# Altium schematic sheet Digital_Input_LED_Monitor.SchDoc: TTL IO LED Monitor
size Tabloid; Date: 05/10/2023; Engineer: Terry D. Schevker; Revision: 1.0; SheetNumber: 3; SheetTotal: 3
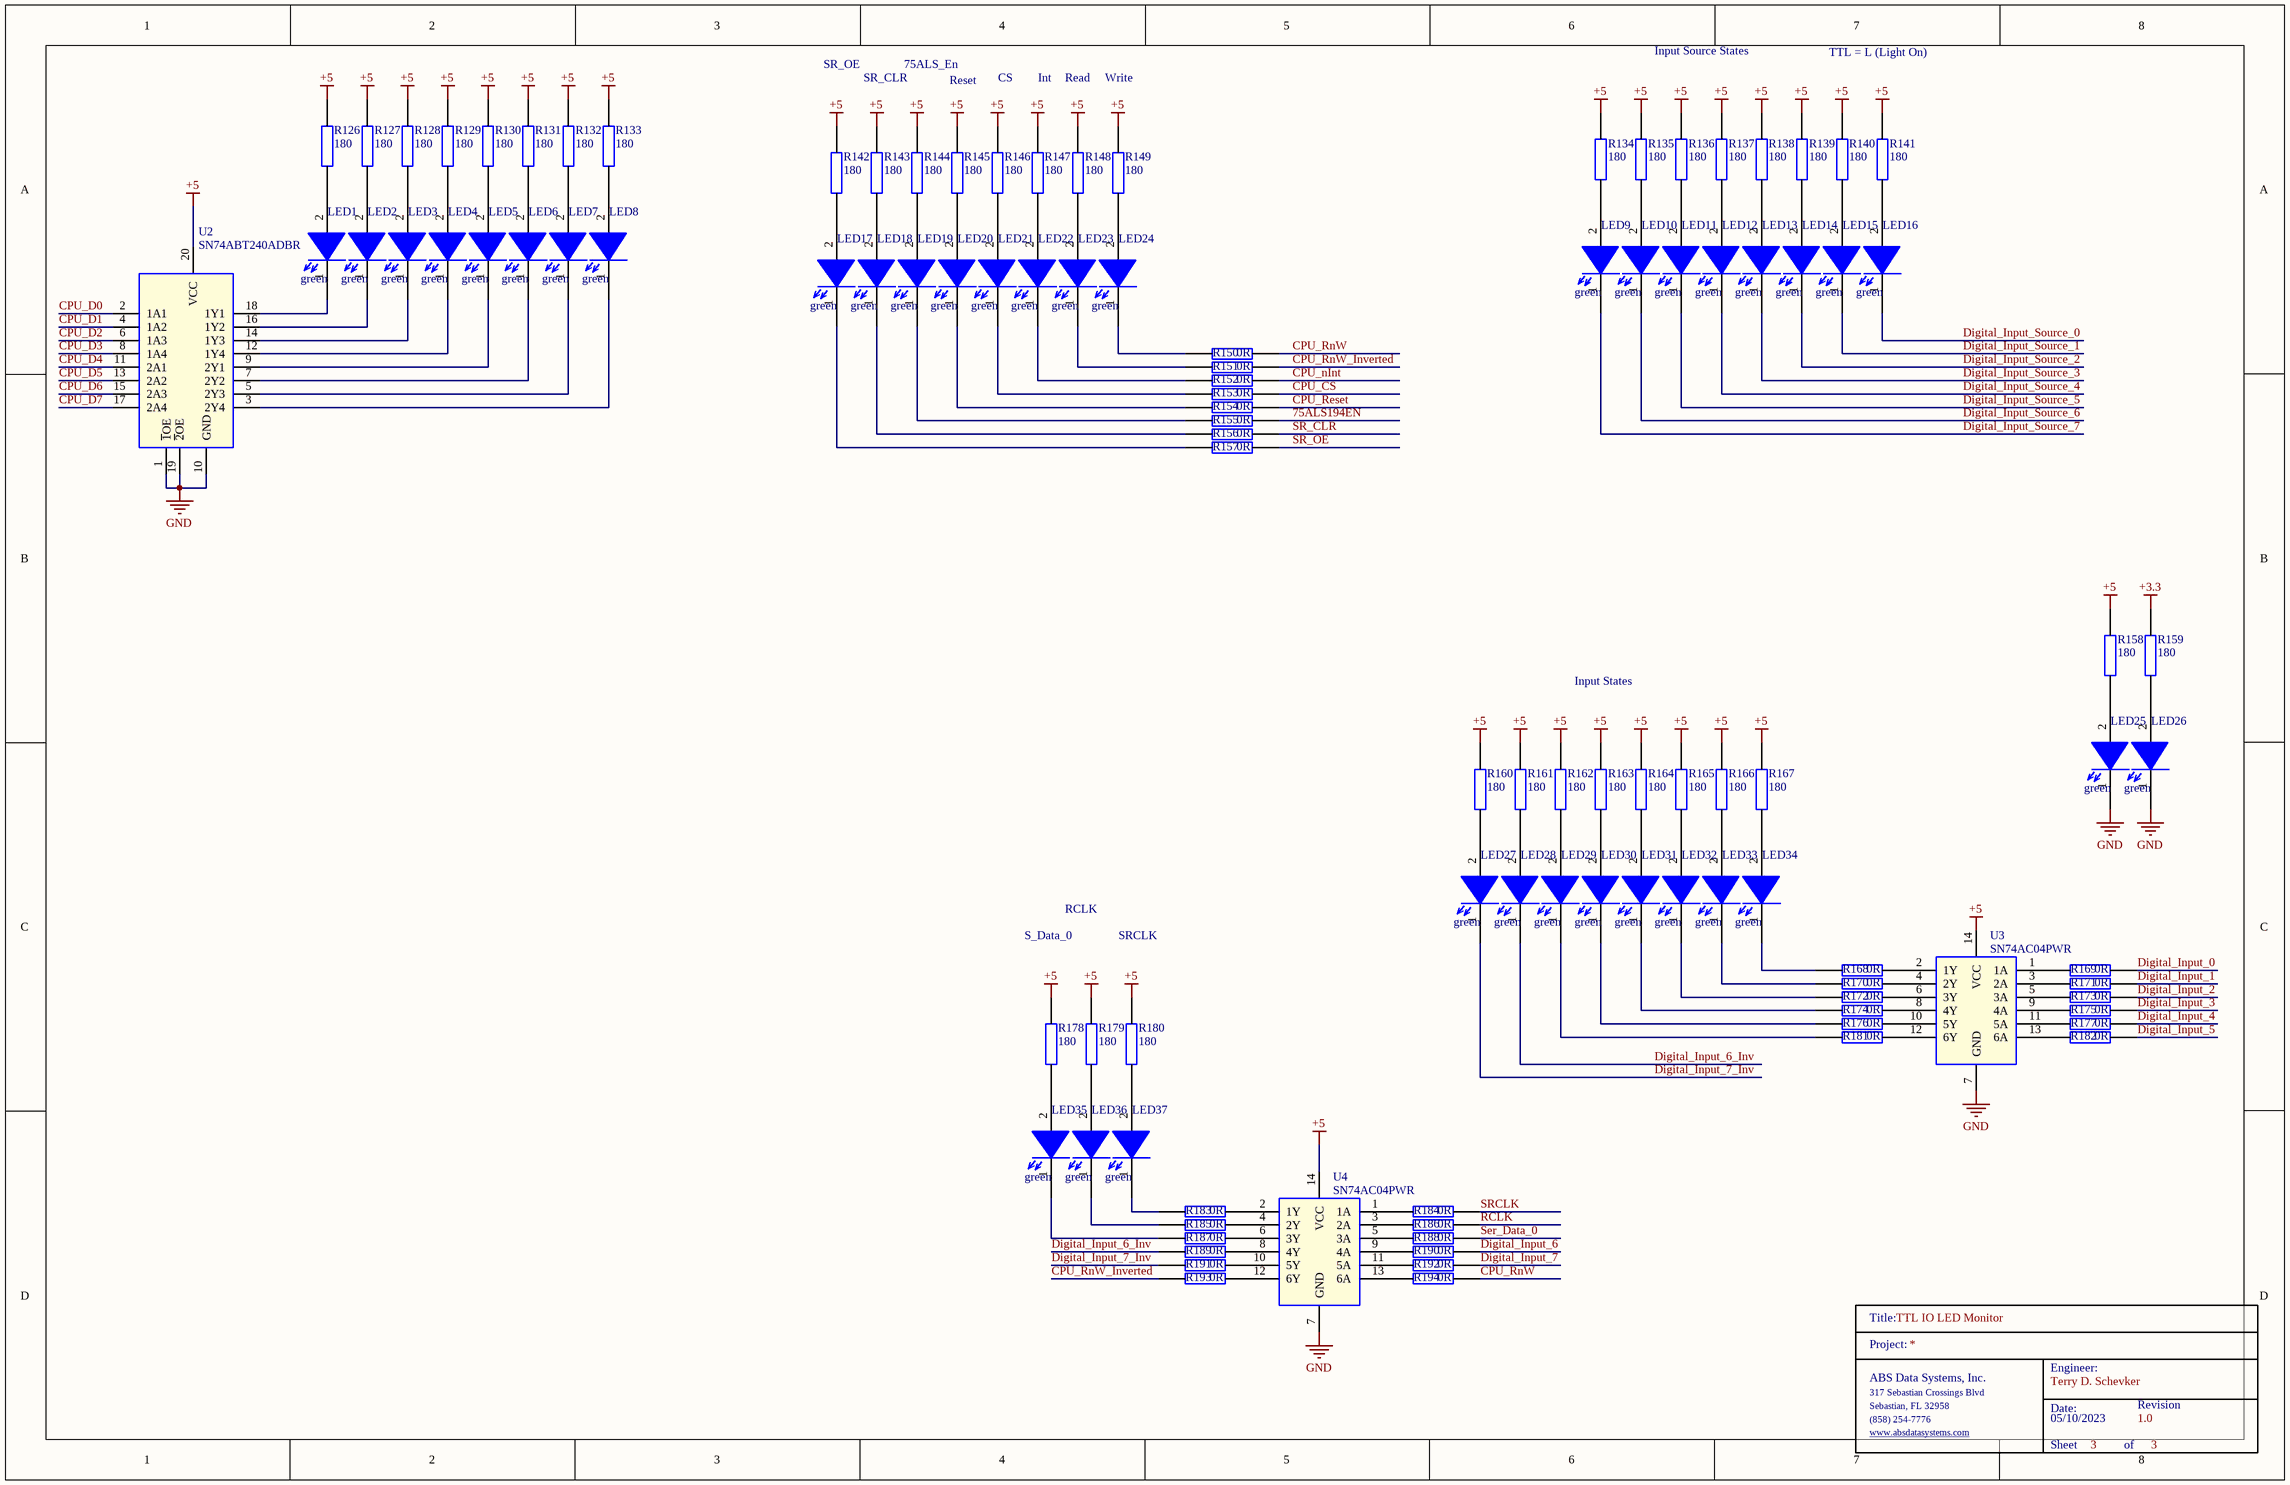
[diagram p0: Digital_Input_LED_Monitor.SchDoc]

## Parts
LED1  green  [0603_Diode]
LED2  green  [0603_Diode]
LED3  green  [0603_Diode]
LED4  green  [0603_Diode]
LED5  green  [0603_Diode]
LED6  green  [0603_Diode]
LED7  green  [0603_Diode]
LED8  green  [0603_Diode]
LED9  green  [0603_Diode]
LED10  green  [0603_Diode]
LED11  green  [0603_Diode]
LED12  green  [0603_Diode]
LED13  green  [0603_Diode]
LED14  green  [0603_Diode]
LED15  green  [0603_Diode]
LED16  green  [0603_Diode]
LED17  green  [0603_Diode]
LED18  green  [0603_Diode]
LED19  green  [0603_Diode]
LED20  green  [0603_Diode]
LED21  green  [0603_Diode]
LED22  green  [0603_Diode]
LED23  green  [0603_Diode]
LED24  green  [0603_Diode]
LED25  green  [0603_Diode]
LED26  green  [0603_Diode]
LED27  green  [0603_Diode]
LED28  green  [0603_Diode]
LED29  green  [0603_Diode]
LED30  green  [0603_Diode]
LED31  green  [0603_Diode]
LED32  green  [0603_Diode]
LED33  green  [0603_Diode]
LED34  green  [0603_Diode]
LED35  green  [0603_Diode]
LED36  green  [0603_Diode]
LED37  green  [0603_Diode]
R126  180  [0603]
R127  180  [0603]
R128  180  [0603]
R129  180  [0603]
R130  180  [0603]
R131  180  [0603]
R132  180  [0603]
R133  180  [0603]
R134  180  [0603]
R135  180  [0603]
R136  180  [0603]
R137  180  [0603]
R138  180  [0603]
R139  180  [0603]
R140  180  [0603]
R141  180  [0603]
R142  180  [0603]
R143  180  [0603]
R144  180  [0603]
R145  180  [0603]
R146  180  [0603]
R147  180  [0603]
R148  180  [0603]
R149  180  [0603]
R150  0R  [0603]
R151  0R  [0603]
R152  0R  [0603]
R153  0R  [0603]
R154  0R  [0603]
R155  0R  [0603]
R156  0R  [0603]
R157  0R  [0603]
R158  180  [0603]
R159  180  [0603]
R160  180  [0603]
R161  180  [0603]
R162  180  [0603]
R163  180  [0603]
R164  180  [0603]
R165  180  [0603]
R166  180  [0603]
R167  180  [0603]
R168  0R  [0603]
R169  0R  [0603]
R170  0R  [0603]
R171  0R  [0603]
R172  0R  [0603]
R173  0R  [0603]
R174  0R  [0603]
R175  0R  [0603]
R176  0R  [0603]
R177  0R  [0603]
R178  180  [0603]
R179  180  [0603]
R180  180  [0603]
R181  0R  [0603]
R182  0R  [0603]
R183  0R  [0603]
R184  0R  [0603]
R185  0R  [0603]
R186  0R  [0603]
R187  0R  [0603]
R188  0R  [0603]
R189  0R  [0603]
R190  0R  [0603]
R191  0R  [0603]
R192  0R  [0603]
R193  0R  [0603]
R194  0R  [0603]
TitleBlock_2  TitleBlock  (value not drawn)  (graphical)
U2  SN74ABT240ADBR  [SOP65P780X200-20N]
U3  SN74AC04PWR  [SOP65P640X120-14N]
U4  SN74AC04PWR  [SOP65P640X120-14N]

## Nets
+3.3: R159.2
+5: R126.2 R127.2 R128.2 R129.2 R130.2 R131.2 R132.2 R133.2 R134.2 R135.2 R136.2 R137.2 R138.2 R139.2 R140.2 R141.2 R142.2 R143.2 R144.2 R145.2 R146.2 R147.2 R148.2 R149.2 R158.2 R160.2 R161.2 R162.2 R163.2 R164.2 R165.2 R166.2 R167.2 R178.2 R179.2 R180.2 U2.20(VCC) U3.14(VCC) U4.14(VCC)
GND: LED25.1(K) LED26.1(K) U2.1(~{1}OE) U2.10(GND) U2.19(~{2}OE) U3.7(GND) U4.7(GND)
75ALS194EN: R155.2
CPU_CS: R153.2
CPU_D0: U2.2(1A1)
CPU_D1: U2.4(1A2)
CPU_D2: U2.6(1A3)
CPU_D3: U2.8(1A4)
CPU_D4: U2.11(2A1)
CPU_D5: U2.13(2A2)
CPU_D6: U2.15(2A3)
CPU_D7: U2.17(2A4)
CPU_nInt: R152.2
CPU_Reset: R154.2
CPU_RnW: R150.2 R194.2
CPU_RnW_Inverted: R151.2 R193.1
Digital_Input_0: R169.2
Digital_Input_1: R171.2
Digital_Input_2: R173.2
Digital_Input_3: R175.2
Digital_Input_4: R177.2
Digital_Input_5: R182.2
Digital_Input_6: R190.2
Digital_Input_6_Inv: LED28.1(K) R189.1
Digital_Input_7: R192.2
Digital_Input_7_Inv: LED27.1(K) R191.1
Digital_Input_Source_0: LED16.1(K)
Digital_Input_Source_1: LED15.1(K)
Digital_Input_Source_2: LED14.1(K)
Digital_Input_Source_3: LED13.1(K)
Digital_Input_Source_4: LED12.1(K)
Digital_Input_Source_5: LED11.1(K)
Digital_Input_Source_6: LED10.1(K)
Digital_Input_Source_7: LED9.1(K)
RCLK: R186.2
Ser_Data_0: R188.2
SR_CLR: R156.2
SR_OE: R157.2
SRCLK: R184.2
NetLED1_1: LED1.1(K) U2.18(1Y1)
NetLED1_2: LED1.2(A) R126.1
NetLED2_1: LED2.1(K) U2.16(1Y2)
NetLED2_2: LED2.2(A) R127.1
NetLED3_1: LED3.1(K) U2.14(1Y3)
NetLED3_2: LED3.2(A) R128.1
NetLED4_1: LED4.1(K) U2.12(1Y4)
NetLED4_2: LED4.2(A) R129.1
NetLED5_1: LED5.1(K) U2.9(2Y1)
NetLED5_2: LED5.2(A) R130.1
NetLED6_1: LED6.1(K) U2.7(2Y2)
NetLED6_2: LED6.2(A) R131.1
NetLED7_1: LED7.1(K) U2.5(2Y3)
NetLED7_2: LED7.2(A) R132.1
NetLED8_1: LED8.1(K) U2.3(2Y4)
NetLED8_2: LED8.2(A) R133.1
NetLED9_2: LED9.2(A) R134.1
NetLED10_2: LED10.2(A) R135.1
NetLED11_2: LED11.2(A) R136.1
NetLED12_2: LED12.2(A) R137.1
NetLED13_2: LED13.2(A) R138.1
NetLED14_2: LED14.2(A) R139.1
NetLED15_2: LED15.2(A) R140.1
NetLED16_2: LED16.2(A) R141.1
NetLED17_1: LED17.1(K) R157.1
NetLED17_2: LED17.2(A) R142.1
NetLED18_1: LED18.1(K) R156.1
NetLED18_2: LED18.2(A) R143.1
NetLED19_1: LED19.1(K) R155.1
NetLED19_2: LED19.2(A) R144.1
NetLED20_1: LED20.1(K) R154.1
NetLED20_2: LED20.2(A) R145.1
NetLED21_1: LED21.1(K) R153.1
NetLED21_2: LED21.2(A) R146.1
NetLED22_1: LED22.1(K) R152.1
NetLED22_2: LED22.2(A) R147.1
NetLED23_1: LED23.1(K) R151.1
NetLED23_2: LED23.2(A) R148.1
NetLED24_1: LED24.1(K) R150.1
NetLED24_2: LED24.2(A) R149.1
NetLED25_2: LED25.2(A) R158.1
NetLED26_2: LED26.2(A) R159.1
NetLED27_2: LED27.2(A) R160.1
NetLED28_2: LED28.2(A) R161.1
NetLED29_1: LED29.1(K) R181.1
NetLED29_2: LED29.2(A) R162.1
NetLED30_1: LED30.1(K) R176.1
NetLED30_2: LED30.2(A) R163.1
NetLED31_1: LED31.1(K) R174.1
NetLED31_2: LED31.2(A) R164.1
NetLED32_1: LED32.1(K) R172.1
NetLED32_2: LED32.2(A) R165.1
NetLED33_1: LED33.1(K) R170.1
NetLED33_2: LED33.2(A) R166.1
NetLED34_1: LED34.1(K) R168.1
NetLED34_2: LED34.2(A) R167.1
NetLED35_1: LED35.1(K) R187.1
NetLED35_2: LED35.2(A) R178.1
NetLED36_1: LED36.1(K) R185.1
NetLED36_2: LED36.2(A) R179.1
NetLED37_1: LED37.1(K) R183.1
NetLED37_2: LED37.2(A) R180.1
NetR168_2: R168.2 U3.2(1Y)
NetR169_1: R169.1 U3.1(1A)
NetR170_2: R170.2 U3.4(2Y)
NetR171_1: R171.1 U3.3(2A)
NetR172_2: R172.2 U3.6(3Y)
NetR173_1: R173.1 U3.5(3A)
NetR174_2: R174.2 U3.8(4Y)
NetR175_1: R175.1 U3.9(4A)
NetR176_2: R176.2 U3.10(5Y)
NetR177_1: R177.1 U3.11(5A)
NetR181_2: R181.2 U3.12(6Y)
NetR182_1: R182.1 U3.13(6A)
NetR183_2: R183.2 U4.2(1Y)
NetR184_1: R184.1 U4.1(1A)
NetR185_2: R185.2 U4.4(2Y)
NetR186_1: R186.1 U4.3(2A)
NetR187_2: R187.2 U4.6(3Y)
NetR188_1: R188.1 U4.5(3A)
NetR189_2: R189.2 U4.8(4Y)
NetR190_1: R190.1 U4.9(4A)
NetR191_2: R191.2 U4.10(5Y)
NetR192_1: R192.1 U4.11(5A)
NetR193_2: R193.2 U4.12(6Y)
NetR194_1: R194.1 U4.13(6A)

## Notes on the sheet
- SR_OE
- SR_CLR
- 75ALS_En
- Reset
- CS
- Int
- Read
- Write
- Input Source States
- TTL = L (Light On)
- Input States
- S_Data_0
- RCLK
- SRCLK
- (in symbol TitleBlock) Title:; Project:; Engineer:; ABS Data Systems, Inc.; 317 Sebastian Crossings Blvd; Sebastian, FL 32958; Date:; Revision; (858) 254-7776; www.absdatasystems.com; Sheet; of

## Library data of the parts
LED1-LED37 = 150060GS75000: Wurth Elektronik 0603 green; Manufacturer: Wurth Electronics; Wavelength: 520nm; Viewing Angle: 140°; Lens Style: Clear,Rectangular; Luminous Intensity: 430mcd; Forward Current: 30mA; Forward Voltage: 3.2V; Test Current: 20mA; Supplier 1: Digi-Key; Manufacturer Part Number: 150060GS75000; RoHS: Yes; Category: LEDs; Stock 1: 71509; Pricing 1: 1=0.14000, 50=0.13300, 100=0.11400, 500=0.09900 (USD); Mount: Surface Mount; Case/Package: 0603; Color: Green; Case Code (Metric): 1608; Case Code (Imperial): 0603; Min Operating Temperature: -40°C; Max Operating Temperature: 85°C; Package Quantity: 4000; Packaging: Tape and Reel; Dominant Wavelength: 520nm; Length: 1.6mm; Width: 0.8mm; Height: 0.7mm; REACH SVHC: Unknown; Lead Free: Lead Free; ComponentLink1URL: https://datasheet.ciiva.com/29562/150060gs75000-29562868.pdf?src-supplier=Digi-Key; ComponentLink1Description: https://datasheet.ciiva.com/29562/150060gs75000-29562868.pdf?src-supplier=Digi-Key; ComponentLink2URL: https://datasheet.ciiva.com/29279/759427-da-01-en-chipled-0603-w-kl-gruen-150060gs75000-29279201.pdf?src-supplier=Conrad; ComponentLink2Description: https://datasheet.ciiva.com/29279/759427-da-01-en-chipled-0603-w-kl-gruen-150060gs75000-29279201.pdf?src-supplier=Conrad; ComponentLink3URL: https://datasheet.ciiva.com/29562/150060gs75000-29562869.pdf?src-supplier=Digi-Key; ComponentLink3Description: https://datasheet.ciiva.com/29562/150060gs75000-29562869.pdf?src-supplier=Digi-Key; ComponentLink4URL: https://datasheet.ciiva.com/29562/150060gs75000-29562870.pdf?src-supplier=Digi-Key; ComponentLink4Description: https://datasheet.ciiva.com/29562/150060gs75000-29562870.pdf?src-supplier=Digi-Key
R126-R149 R158-R167 R178-R180 = RC0603FR-13180RL: YAGEO 0603 180 ohm; Manufacturer_Name: KEMET; Manufacturer_Part_Number: RC0603JR-070RL; Geometry.Height: 0.55mm; Mouser Part Number: 603-RC0603JR-070RL; Mouser Price/Stock: https://www.mouser.co.uk/ProductDetail/YAGEO/RC0603JR-070RL?qs=2cAdsCoAWRGWyPcuXgGiXQ%3D%3D; Datasheet Link: https://datasheet.datasheetarchive.com/originals/distributors/Datasheets_SAMA/902f9e387b938f871d31120f5fc1d65e.pdf
R150-R157 R168-R177 R181-R194 = RC0603JR-070RL: YAGEO 0603 0 ohm; Manufacturer_Name: KEMET; Geometry.Height: 0.55mm; Mouser Part Number: 603-RC0603JR-070RL; Mouser Price/Stock: https://www.mouser.co.uk/ProductDetail/YAGEO/RC0603JR-070RL?qs=2cAdsCoAWRGWyPcuXgGiXQ%3D%3D; Manufacturer_Part_Number: RC0603JR-070RL; Datasheet Link: https://datasheet.datasheetarchive.com/originals/distributors/Datasheets_SAMA/902f9e387b938f871d31120f5fc1d65e.pdf
U2 = SN74ABT240ADBR: Octal Buffers/Drivers With 3-State Outputs; Manufacturer_Name: Texas Instruments; Geometry.Height: 2mm; Mouser Part Number: 595-SN74ABT240ADBR; Mouser Price/Stock: https://www.mouser.co.uk/ProductDetail/Texas-Instruments/SN74ABT240ADBR?qs=JHHQeKcAU3Dt82k%252BVyiYdw%3D%3D; Manufacturer_Part_Number: SN74ABT240ADBR; Datasheet Link: http://www.ti.com/lit/gpn/sn74abt240a
U3 U4 = SN74AC04PWR: Hex Inverters; Manufacturer_Name: Texas Instruments; Geometry.Height: 1.2mm; Mouser Part Number: 595-SN74AC04PWR; Mouser Price/Stock: https://www.mouser.co.uk/ProductDetail/Texas-Instruments/SN74AC04PWR?qs=RZS%252BpEsUn7pRvPNqsga4SA%3D%3D; Manufacturer_Part_Number: SN74AC04PWR; Datasheet Link: http://www.ti.com/lit/gpn/sn74ac04